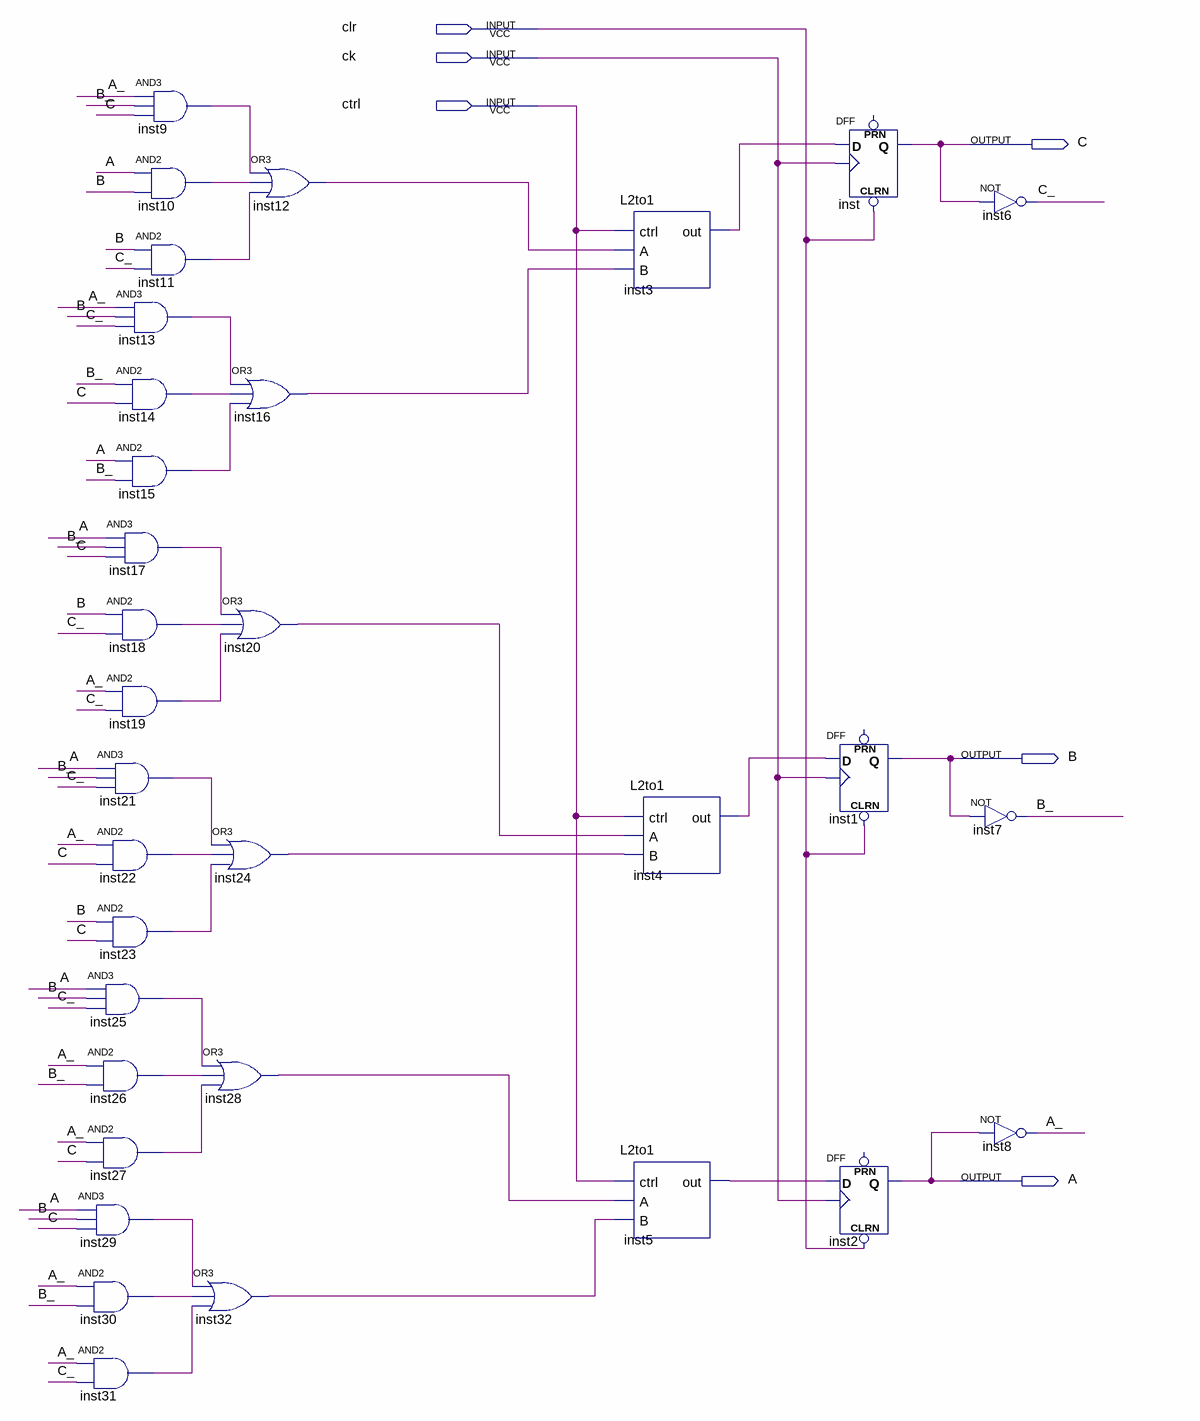
[diagram p0: schematic sheet]
// Quartus schematic fsm.bdf as structural Verilog: 33 symbols, 6 pins
module fsm (
  input  clr,
  input  ck,
  input  ctrl,
  output C,
  output B,
  output A
);

  wire A_, B_, C_, inst3_out, inst4_out, inst5_out, inst9_out, inst10_out, inst11_out, inst12_out,
       inst13_out, inst14_out, inst15_out, inst16_out, inst17_out, inst18_out, inst19_out, inst20_out,
       inst21_out, inst22_out, inst23_out, inst24_out, inst25_out, inst26_out, inst27_out, inst28_out,
       inst29_out, inst30_out, inst31_out, inst32_out;

  and inst9 (inst9_out, A_, B_, C);
  and inst10 (inst10_out, A, B);
  and inst11 (inst11_out, B, C_);
  and inst13 (inst13_out, A_, B, C_);
  and inst14 (inst14_out, B_, C);
  and inst15 (inst15_out, A, B_);
  and inst17 (inst17_out, A, B_, C);
  and inst18 (inst18_out, B, C_);
  and inst19 (inst19_out, A_, C_);
  and inst21 (inst21_out, A, B_, C_);
  and inst22 (inst22_out, A_, C);
  and inst23 (inst23_out, B, C);
  and inst25 (inst25_out, A, B, C_);
  and inst26 (inst26_out, A_, B_);
  and inst27 (inst27_out, A_, C);
  and inst29 (inst29_out, A, B, C);
  and inst30 (inst30_out, A_, B_);
  and inst31 (inst31_out, A_, C_);
  or inst20 (inst20_out, inst17_out, inst18_out, inst19_out);
  or inst24 (inst24_out, inst21_out, inst22_out, inst23_out);
  or inst28 (inst28_out, inst25_out, inst26_out, inst27_out);
  or inst32 (inst32_out, inst29_out, inst30_out, inst31_out);
  or inst12 (inst12_out, inst9_out, inst10_out, inst11_out);
  or inst16 (inst16_out, inst13_out, inst14_out, inst15_out);
  L2to1 inst3 (.ctrl(ctrl), .A(inst12_out), .B(inst16_out), .out(inst3_out));
  L2to1 inst4 (.ctrl(ctrl), .A(inst20_out), .B(inst24_out), .out(inst4_out));
  L2to1 inst5 (.ctrl(ctrl), .A(inst28_out), .B(inst32_out), .out(inst5_out));
  DFF inst (.CLRN(clr), .CLK(ck), .D(inst3_out), .Q(C));  // open: PRN
  DFF inst1 (.CLRN(clr), .CLK(ck), .D(inst4_out), .Q(B));  // open: PRN
  DFF inst2 (.CLRN(clr), .CLK(ck), .D(inst5_out), .Q(A));  // open: PRN
  not inst6 (C_, C);
  not inst7 (B_, B);
  not inst8 (A_, A);
endmodule
